# EAGLE design Data-logger_v01-03 (EAGLE 9.6.2)
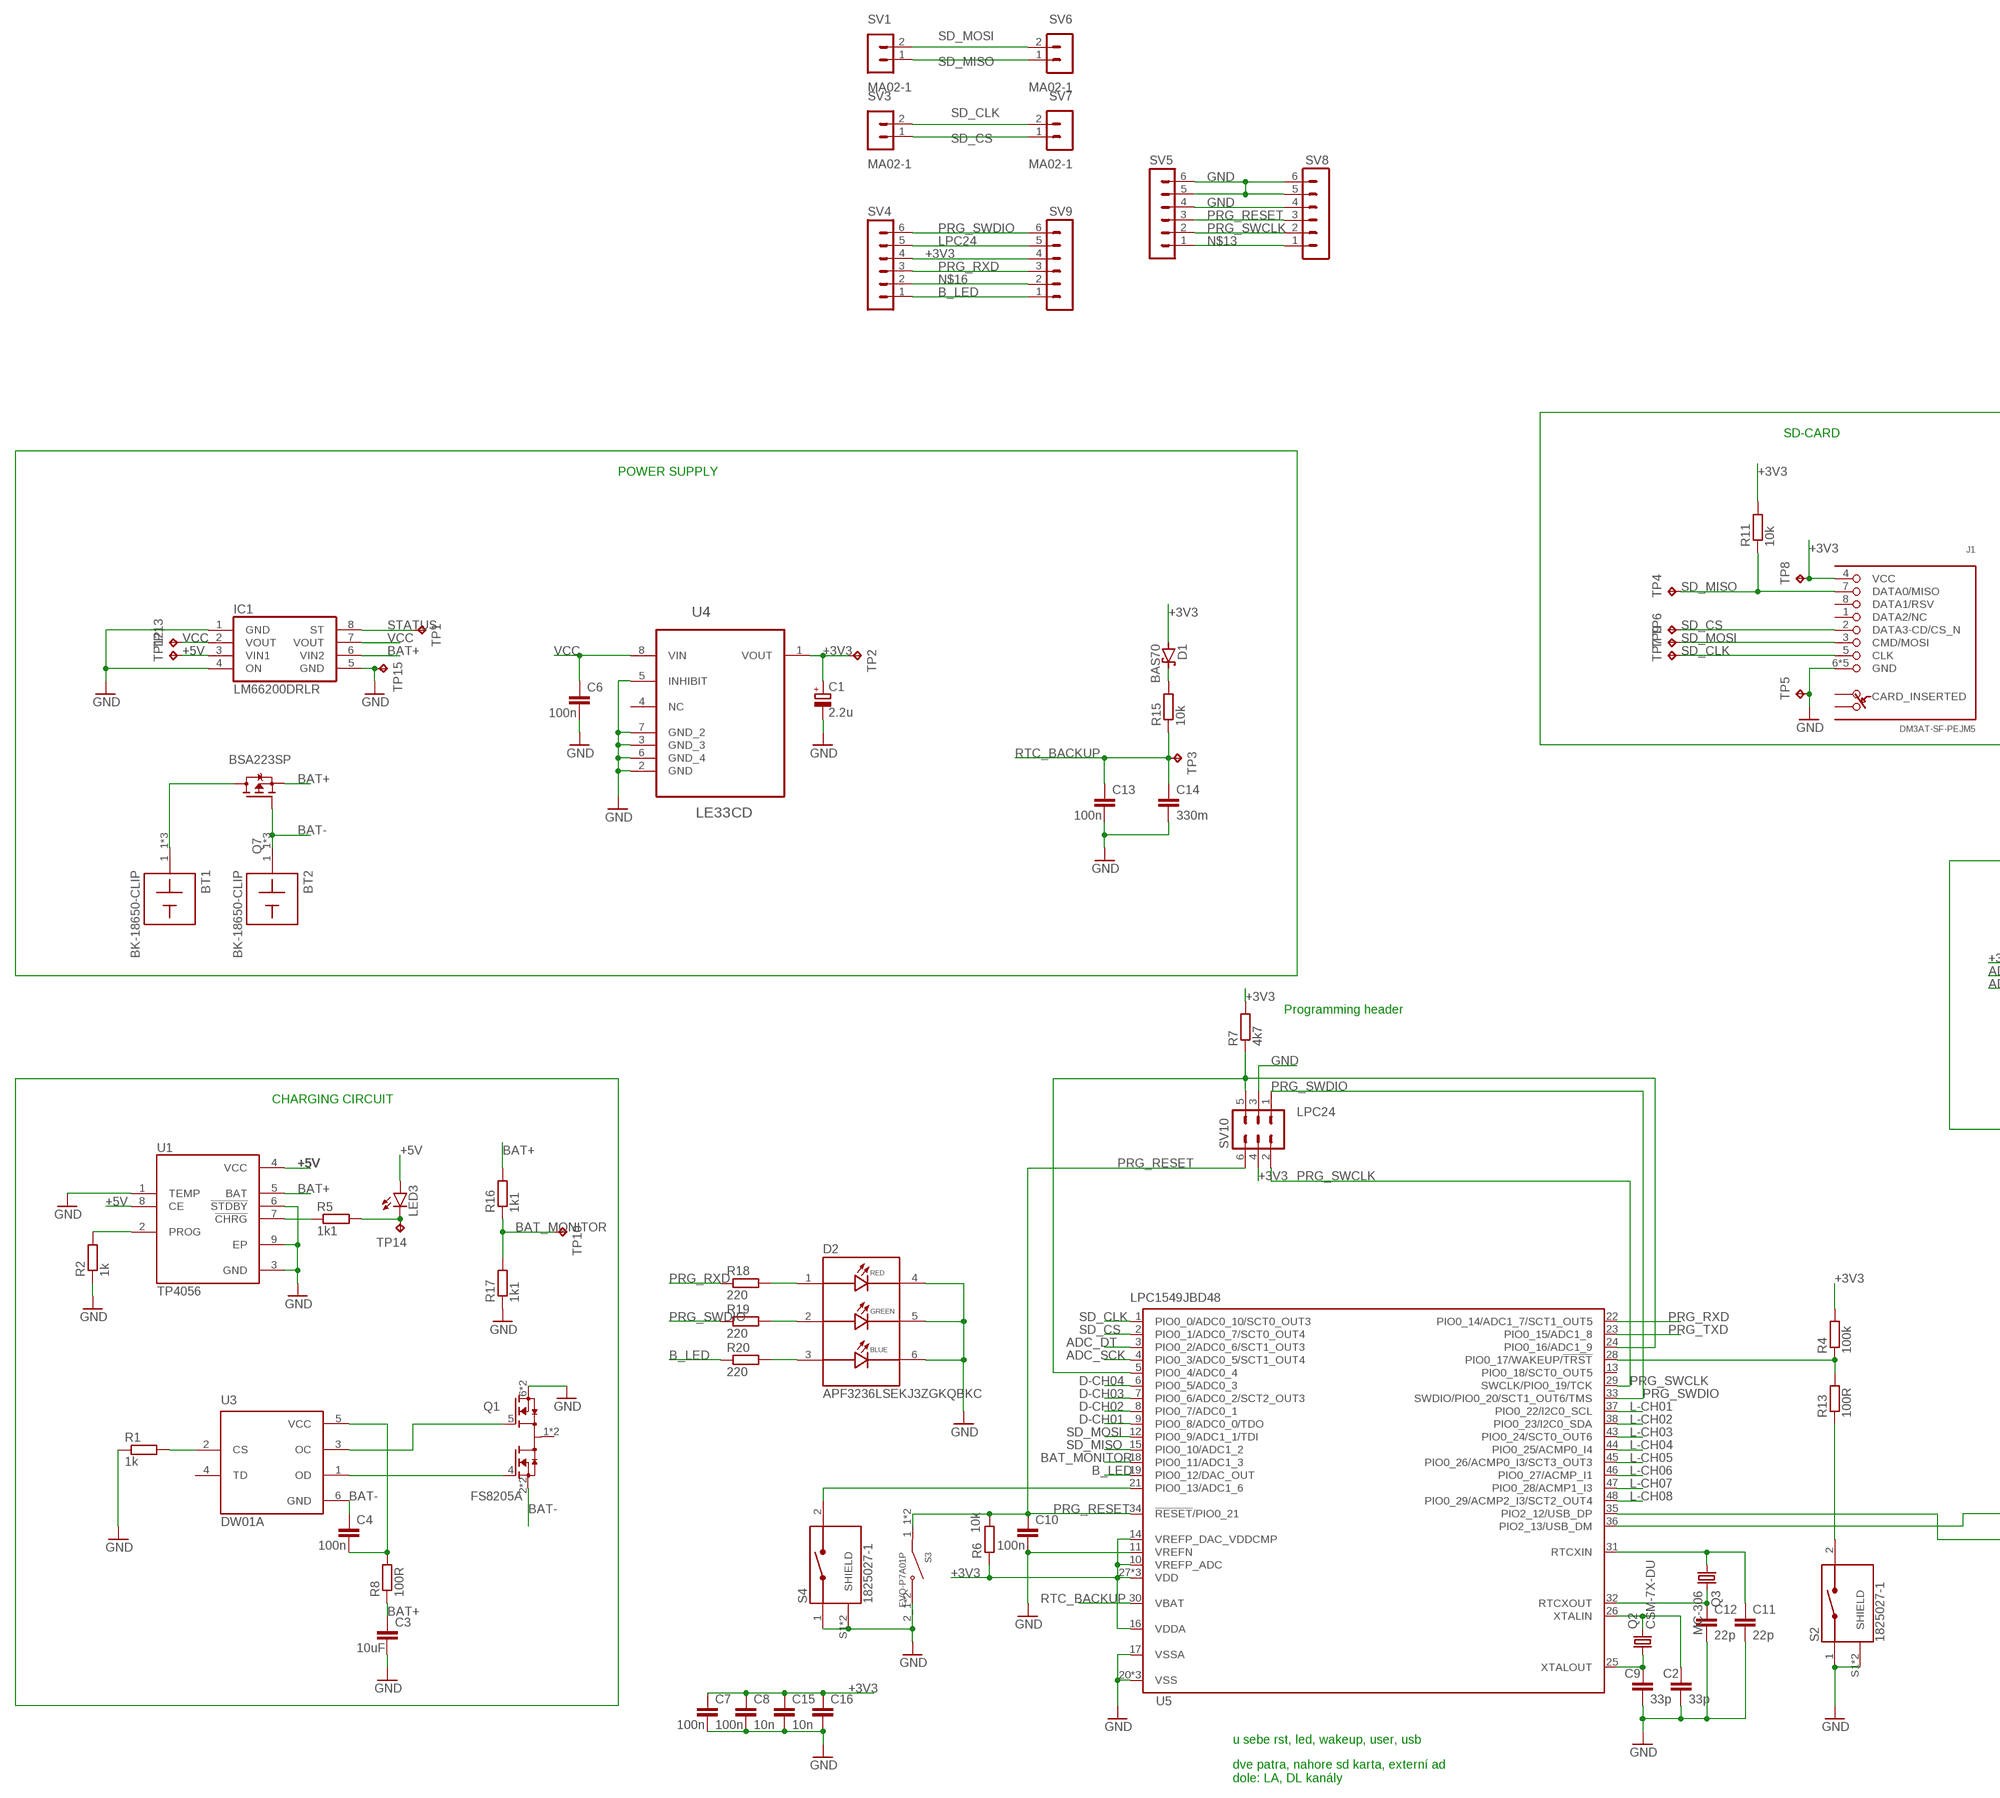
[diagram p0: schematic, sheet 1, part 1 of 2]
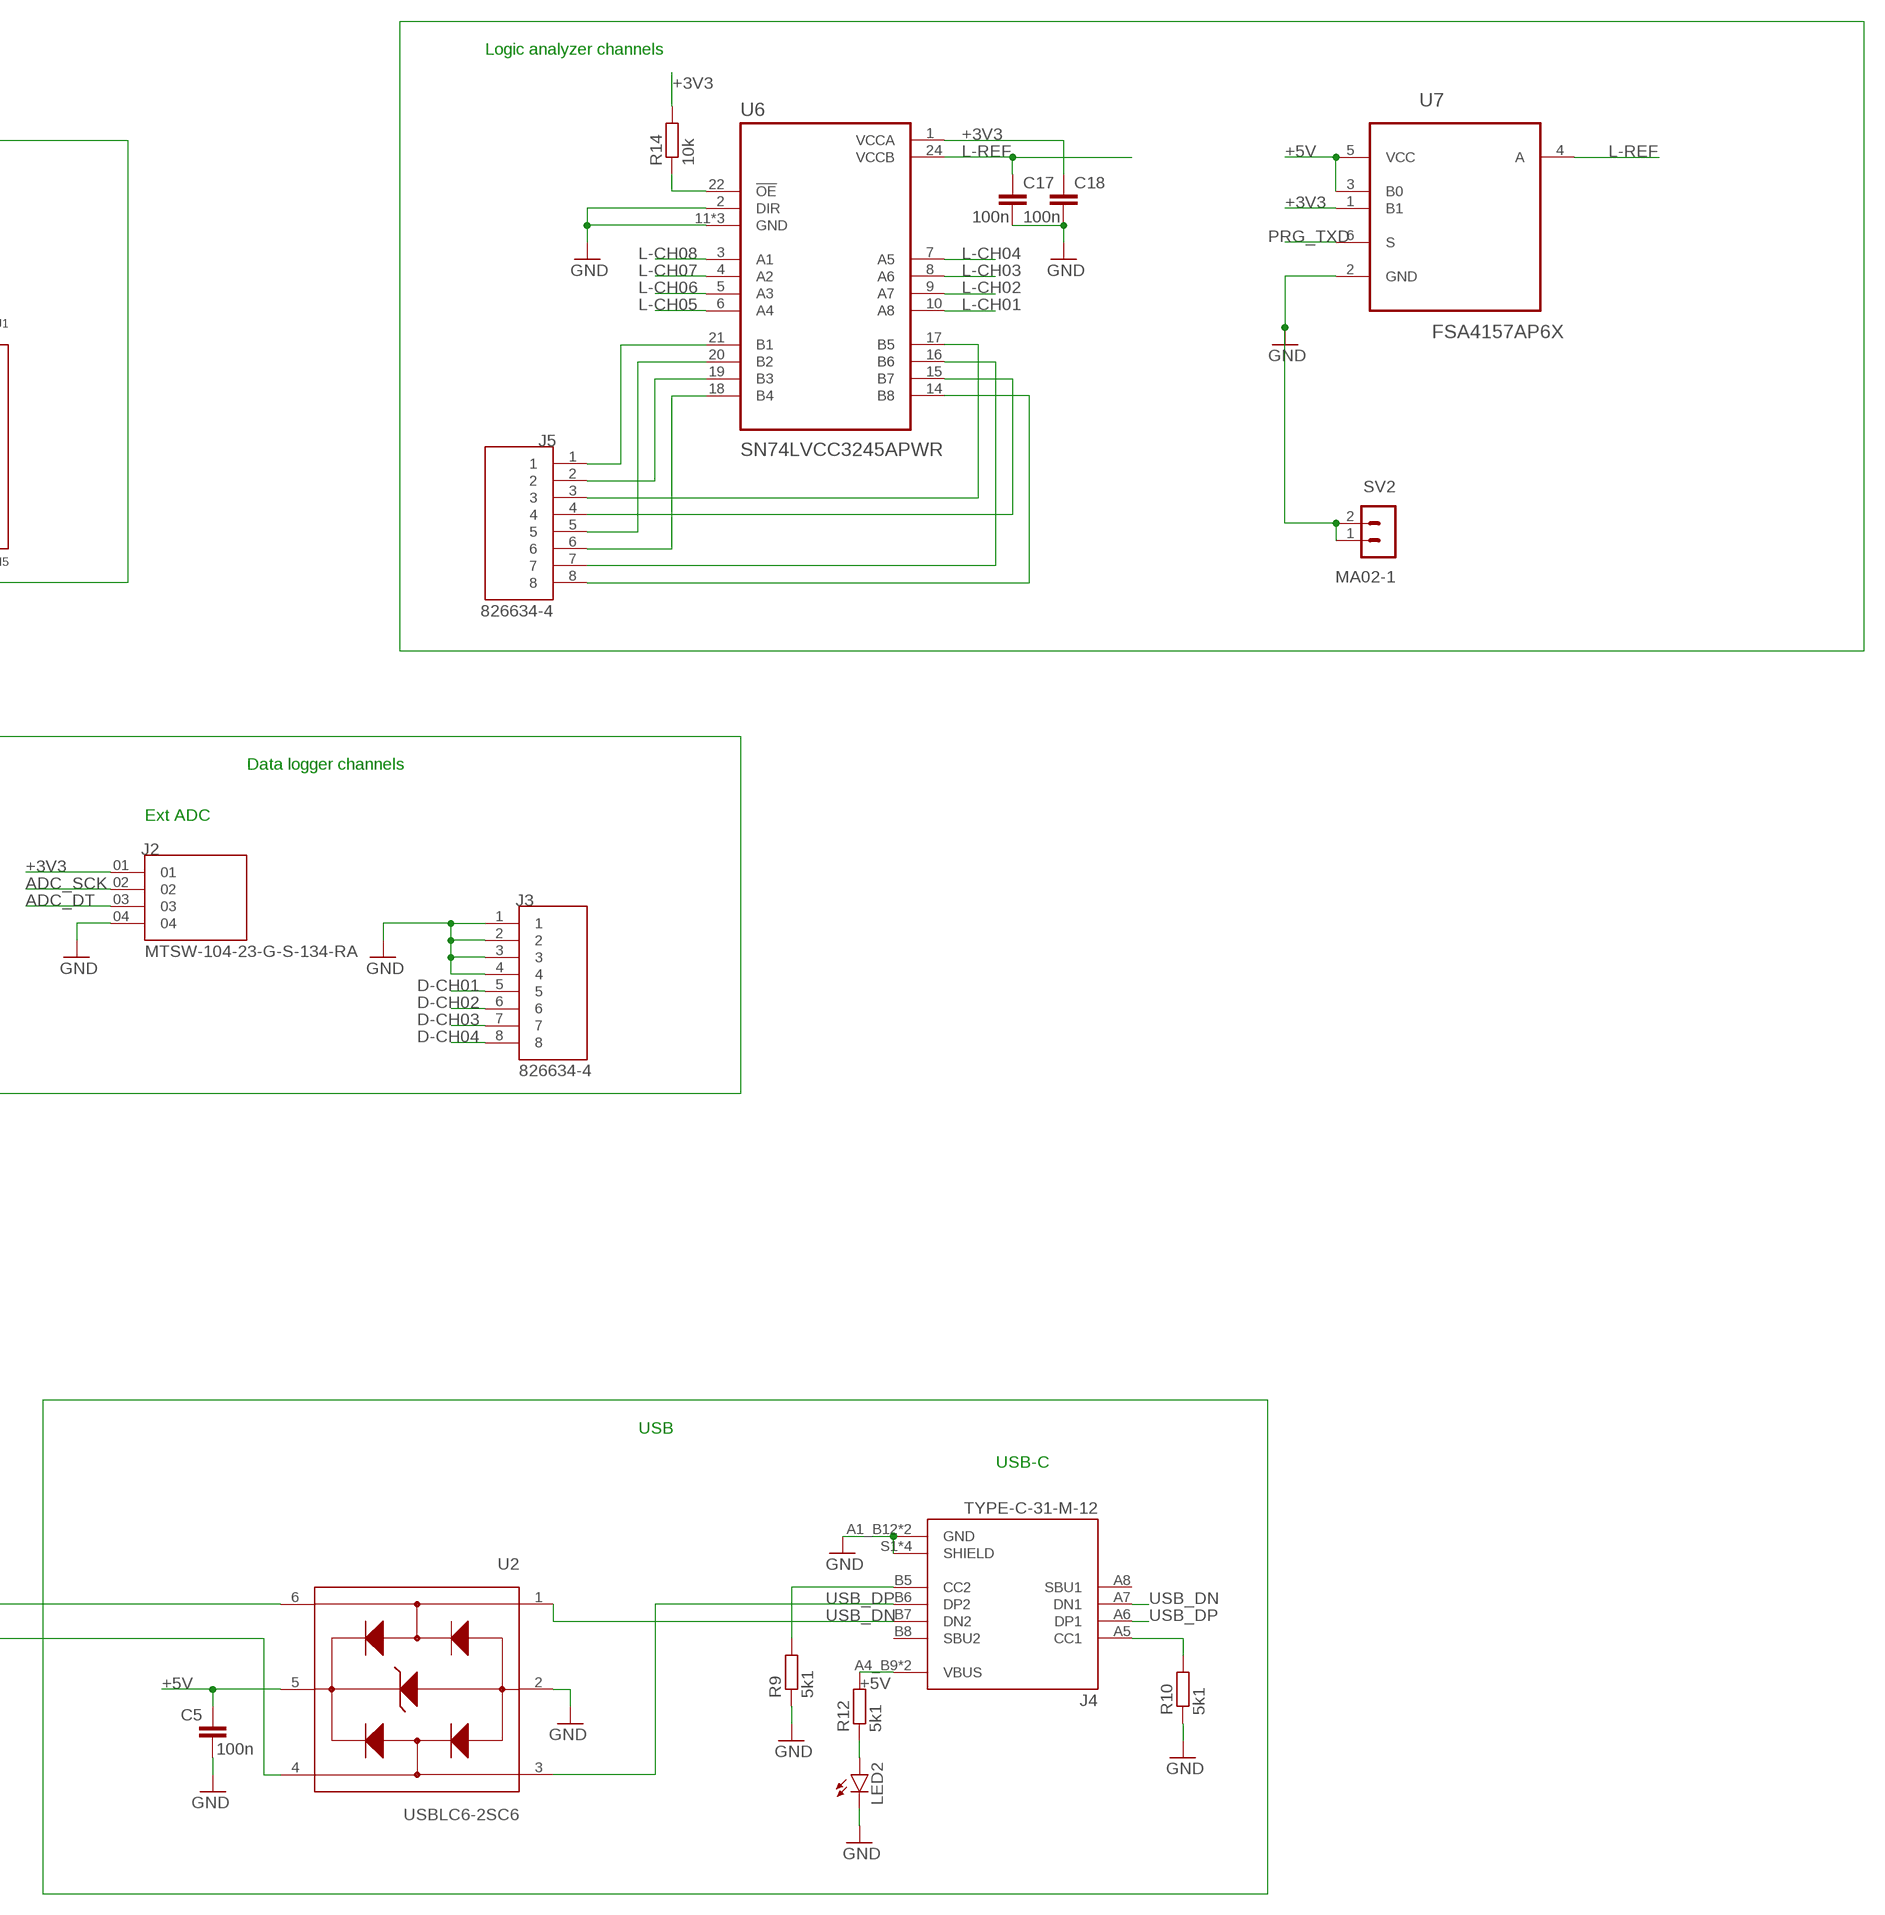
[diagram p1: schematic, sheet 1, part 2 of 2]

## Parts
BT1  BK-18650-CLIP  [BAT_BK-18650-CLIP]
BT2  BK-18650-CLIP  [BAT_BK-18650-CLIP]
C1  2.2u  CPOL-EU140CLH-0810  [140CLH-0810]
C2  33p  C-EUC0805  [C0805]
C3  10uF  C-EUC0805  [C0805]
C4  100n  C-EUC0805  [C0805]
C5  100n  C-EUC0805  [C0805]
C6  100n  C-EUC0805  [C0805]
C7  100n  C-EUC0805  [C0805]
C8  100n  C-EUC0805  [C0805]
C9  33p  C-EUC0805  [C0805]
C10  100n  C-EUC0805  [C0805]
C11  22p  C-EUC0805  [C0805]
C12  22p  C-EUC0805  [C0805]
C13  100n  C-EUC0805  [C0805]
C14  330m  C-EU050-050X075  [C050-050X075]
C15  10n  C-EUC0805  [C0805]
C16  10n  C-EUC0805  [C0805]
C17  100n  C-EUC0805  [C0805]
C18  100n  C-EUC0805  [C0805]
D1  BAS70  [SOT23]
D2  APF3236LSEKJ3ZGKQBKC  [LED_APF3236LSEKJ3ZGKQBKC]
IC1  LM66200DRLR  [SOT8]
J1  DM3AT-SF-PEJM5  [DM3AT-SF-PEJM5]
J2  MTSW-104-23-G-S-134-RA  [SAMTEC_MTSW-104-23-G-S-134-RA]
J3  826634-4  [TE_826634-4]
J4  TYPE-C-31-M-12  [HRO_TYPE-C-31-M-12]
J5  826634-4  [TE_826634-4]
LED2  LEDCHIPLED_1206  [CHIPLED_1206]
LED3  LEDCHIPLED_1206  [CHIPLED_1206]
Q1  FS8205A  [SOP65P640X120-8N]
Q2  CSM-7X-DU  [CSM-7X-DU]
Q3  MC-306  [MC-306]
Q7  BSA223SP  [SC75_INFINEON]
R1  1k  R-EU_R0805  [R0805]
R2  1k  R-EU_R0805  [R0805]
R4  100k  R-EU_R0805  [R0805]
R5  1k1  R-EU_R0805  [R0805]
R6  10k  R-EU_R0805  [R0805]
R7  4k7  R-EU_R0805  [R0805]
R8  100R  R-EU_R0805  [R0805]
R9  5k1  R-EU_R0805  [R0805]
R10  5k1  R-EU_R0805  [R0805]
R11  10k  R-EU_R0805  [R0805]
R12  5k1  R-EU_R0805  [R0805]
R13  100R  R-EU_R0805  [R0805]
R14  10k  R-EU_R0805  [R0805]
R15  10k  R-EU_R0805  [R0805]
R16  1k1  R-EU_R0805  [R0805]
R17  1k1  R-EU_R0805  [R0805]
R18  220  R-EU_R0805  [R0805]
R19  220  R-EU_R0805  [R0805]
R20  220  R-EU_R0805  [R0805]
S2  1825027-1  [SW_1825027-1]
S3  EVQ-P7A01P  [SW_EVQ-P7A01P]
S4  1825027-1  [SW_1825027-1]
SV1  MA02-1  [MA02-1]
SV2  MA02-1  [MA02-1]
SV3  MA02-1  [MA02-1]
SV4  MA06-1  [MA06-1]
SV5  MA06-1  [MA06-1]
SV6  MA02-1  [MA02-1]
SV7  MA02-1  [MA02-1]
SV8  MA06-1  [MA06-1]
SV9  MA06-1  [MA06-1]
SV10  MA03-2  [MA03-2]
TP1  TPB1,27  [B1,27]
TP2  TPB1,27  [B1,27]
TP3  TPB1,27  [B1,27]
TP4  TPB1,27  [B1,27]
TP5  TPB1,27  [B1,27]
TP6  TPB1,27  [B1,27]
TP7  TPB1,27  [B1,27]
TP8  TPB1,27  [B1,27]
TP9  TPB1,27  [B1,27]
TP10  TPB1,27  [B1,27]
TP12  TPB1,27  [B1,27]
TP13  TPB1,27  [B1,27]
TP14  TPB1,27  [B1,27]
TP15  TPB1,27  [B1,27]
U1  TP4056  [SOP127P600X175-9N]
U2  USBLC6-2SC6  [SOT95P280X145-6N]
U3  DW01A  [SOT95P280X145-6N]
U4  LE33CD  [SOIC127P600X175-8N]
U5  LPC1549JBD48  [SOT313-2]
U6  SN74LVCC3245APWR  [SOP65P640X120-24N]
U7  FSA4157AP6X  [SOT65P210X110-6N]

## Nets
+3V3: C1.+ C7.1 C8.1 C15.1 C16.1 C18.1 D1.1(A) J1.4(VCC) J2.01 R4.2 R6.1 R7.2 R11.2 R14.2 SV4.4 SV9.4 SV10.4 TP2.TP TP8.TP U4.1(VOUT) U5.10(VREFP_ADC) U5.14(VREFP_DAC_VDDCMP) U5.16(VDDA) U5.27(VDD) U5.39(VDD) U5.42(VDD) U6.1(VCCA) U7.1(B1)
+5V: C5.1 IC1.3(VIN1) J4.A4_B9(VBUS) J4.B4_A9(VBUS) LED3.A R12.2 TP12.TP U1.4(VCC) U1.8(CE) U2.5(VBUS) U7.3(B0) U7.5(VCC)
ADC_DT: J2.03 U5.3(PIO0_2/ADC0_6/SCT1_OUT3)
ADC_SCK: J2.02 U5.4(PIO0_3/ADC0_5/SCT1_OUT4)
B_LED: R20.1 SV4.1 SV9.1 U5.19(PIO0_12/DAC_OUT)
BAT+: C3.1 IC1.6(VIN2) Q7.3(S) R8.1 R16.2 U1.5(BAT)
BAT-: BT2.1_1 BT2.1_2 BT2.1_3 C4.1 Q1.2(S1) Q1.3(S1) Q7.1(G) U3.6(GND)
BAT_MONITOR: R16.1 R17.2 TP10.TP U5.18(PIO0_11/ADC1_3)
D-CH01: J3.5 U5.9(PIO0_8/ADC0_0/TDO)
D-CH02: J3.6 U5.8(PIO0_7/ADC0_1)
D-CH03: J3.7 U5.7(PIO0_6/ADC0_2/SCT2_OUT3)
D-CH04: J3.8 U5.6(PIO0_5/ADC0_3)
GND: C1.- C2.2 C3.2 C5.2 C6.2 C7.2 C8.2 C9.2 C10.2 C11.2 C12.2 C13.2 C14.2 C15.2 C16.2 C17.2 C18.2 D2.4(R_C) D2.5(G_C) D2.6(B_C) IC1.1(GND) IC1.4(ON) IC1.5(GND) J1.6(GND) J1.MOUNT0(GND) J1.MOUNT1(GND) J1.MOUNT2(GND) J1.MOUNT3(GND) J2.04 J3.1 J3.2 J3.3 J3.4 J4.A1_B12(GND) J4.B1_A12(GND) J4.S1(SHIELD) J4.S2(SHIELD) J4.S3(SHIELD) J4.S4(SHIELD) LED2.C Q1.6(S2) Q1.7(S2) R1.1 R2.1 R9.1 R10.1 R17.1 S2.1 S2.S1(SHIELD) S2.S2(SHIELD) S3.2_1 S3.2_2 S4.1 S4.S1(SHIELD) S4.S2(SHIELD) SV2.1 SV2.2 SV5.4 SV5.5 SV5.6 SV8.4 SV8.5 SV8.6 SV10.3 TP5.TP TP15.TP U1.1(TEMP) U1.3(GND) U1.6(!STDBY) U1.9(EP) U2.2(GND) U4.2(GND) U4.3(GND_3) U4.5(INHIBIT) U4.6(GND_4) U4.7(GND_2) U5.11(VREFN) U5.17(VSSA) U5.20(VSS) U5.40(VSS) U5.41(VSS) U6.2(DIR) U6.11(GND) U6.12(GND) U6.13(GND) U7.2(GND)
L-CH01: U5.37(PIO0_22/I2C0_SCL) U6.10(A8)
L-CH02: U5.38(PIO0_23/I2C0_SDA) U6.9(A7)
L-CH03: U5.43(PIO0_24/SCT0_OUT6) U6.8(A6)
L-CH04: U5.44(PIO0_25/ACMP0_I4) U6.7(A5)
L-CH05: U5.45(PIO0_26/ACMP0_I3/SCT3_OUT3) U6.6(A4)
L-CH06: U5.46(PIO0_27/ACMP_I1) U6.5(A3)
L-CH07: U5.47(PIO0_28/ACMP1_I3) U6.4(A2)
L-CH08: U5.48(PIO0_29/ACMP2_I3/SCT2_OUT4) U6.3(A1)
L-REF: C17.1 U6.24(VCCB) U7.4(A)
LPC24: R7.1 SV4.5 SV9.5 SV10.5 U5.5(PIO0_4/ADC0_4) U5.24(PIO0_16/ADC1_9)
LPC25: C9.1 Q2.1 U5.25(XTALOUT)
LPC26: C2.1 Q2.2 U5.26(XTALIN)
LPC31: C11.1 Q3.1 U5.31(RTCXIN)
LPC32: C12.1 Q3.4 U5.32(RTCXOUT)
LPC_DM: U2.4(I/O2_OUT) U5.35(PIO2_12/USB_DP)
N$1: R2.2 U1.2(PROG)
N$2: C4.2 R8.2 U3.5(VCC)
N$3: R1.2 U3.2(CS)
N$4: Q1.4(G1) U3.1(OD)
N$5: Q1.5(G2) U3.3(OC)
N$6: R5.1 U1.7(!CHRG)
N$7: J4.A5(CC1) R10.2
N$8: LED3.C R5.2 TP14.TP
N$13: R4.1 R13.2 SV5.1 SV8.1 U5.28(PIO0_17/WAKEUP/!TRST)
N$14: R13.1 S2.2
N$15: J4.B5(CC2) R9.2
N$16: S4.2 SV4.2 SV9.2 U5.21(PIO0_13/ADC1_6)
N$19: LED2.A R12.1
N$20: J5.1 U6.21(B1)
N$21: J5.5 U6.20(B2)
N$22: D2.1(R_A) R18.2
N$23: D1.3(C) R15.2
N$24: D2.2(G_A) R19.2
N$25: D2.3(B_A) R20.2
N$26: J5.2 U6.19(B3)
N$27: BT1.1_1 BT1.1_2 BT1.1_3 Q7.2(D)
N$28: J5.6 U6.18(B4)
N$29: J5.3 U6.17(B5)
N$30: J5.7 U6.16(B6)
N$31: J5.8 U6.14(B8)
N$32: J5.4 U6.15(B7)
N$33: U2.6(I/O1_OUT) U5.36(PIO2_13/USB_DM)
N$34: R14.1 U6.22(!OE)
PRG_RESET: C10.1 R6.2 S3.1_1 S3.1_2 SV5.3 SV8.3 SV10.6 U5.34(!RESET!/PIO0_21)
PRG_RXD: R18.1 SV4.3 SV9.3 U5.22(PIO0_14/ADC1_7/SCT1_OUT5)
PRG_SWCLK: SV5.2 SV8.2 SV10.2 U5.29(SWCLK/PIO0_19/TCK)
PRG_SWDIO: R19.1 SV4.6 SV9.6 SV10.1 U5.33(SWDIO/PIO0_20/SCT1_OUT6/TMS)
PRG_TXD: U5.23(PIO0_15/ADC1_8) U7.6(S)
RTC_BACKUP: C13.1 C14.1 R15.1 TP3.TP U5.30(VBAT)
SD_CLK: J1.5(CLK) SV3.2 SV7.2 TP7.TP U5.1(PIO0_0/ADC0_10/SCT0_OUT3)
SD_CS: J1.2(DATA3-CD/CS_N) SV3.1 SV7.1 TP6.TP U5.2(PIO0_1/ADC0_7/SCT0_OUT4)
SD_MISO: J1.7(DATA0/MISO) R11.1 SV1.1 SV6.1 TP4.TP U5.15(PIO0_10/ADC1_2)
SD_MOSI: J1.3(CMD/MOSI) SV1.2 SV6.2 TP9.TP U5.12(PIO0_9/ADC1_1/TDI)
STATUS: IC1.8(ST) TP1.TP
USB_DN: J4.A7(DN1) J4.B7(DN2) U2.1(I/O1_IN)
USB_DP: J4.A6(DP1) J4.B6(DP2) U2.3(I/O2_IN)
VCC: C6.1 IC1.2(VOUT) IC1.7(VOUT) TP13.TP U4.8(VIN)
Unconnected: J1.1(DATA2/NC) J1.8(DATA1/RSV) J1.A J1.B J4.A8(SBU1) J4.B8(SBU2) Q1.1(D12) Q1.8(D12) U3.4(TD) U4.4(NC) U5.13(PIO0_18/SCT0_OUT5)

## Notes on the sheet
- Logic analyzer channels
- SD-CARD
- POWER SUPPLY
- Data logger channels
- Ext ADC
- Programming header
- CHARGING CIRCUIT
- USB
- USB-C
- u sebe rst, led, wakeup, user, usb
- dve patra, nahore sd karta, externí ad
  dole: LA, DL kanály

## Library data of the parts
BT1 BT2 = BK-18650-CLIP:BK-18650-CLIP: Check availability <https://pricing.snapeda.com/parts/BK-18650-CLIP/MPD%20%28Memory%20Protection%20Devices%29/view-part?ref=eda>; AVAILABILITY: In Stock; CHECK_PRICES: https://www.snapeda.com/parts/BK-18650-CLIP/MPD/view-part/?ref=eda; DESCRIPTION: Battery Contact Clip 18650 1 Cell PC Pin; MF: MPD (Memory Protection Devices); MP: BK-18650-CLIP; PACKAGE: None; PRICE: None; SNAPEDA_LINK: https://www.snapeda.com/parts/BK-18650-CLIP/MPD/view-part/?ref=snap
C1 = rcl:CPOL-EU: POLARIZED CAPACITOR, European symbol; SPICEPREFIX: C
C2-C18 = rcl:C-EU: CAPACITOR, European symbol; SPICEPREFIX: C
D1 = diode:BAS70: Silicon Schottky Diodes General-purpose diode for high-speed switching
D2 = rgb_led:APF3236LSEKJ3ZGKQBKC: Check availability <https://pricing.snapeda.com/parts/APF3236LSEKJ3ZGKQBKC/Kingbright/view-part?ref=eda>; AVAILABILITY: In Stock; CHECK_PRICES: https://www.snapeda.com/parts/APF3236LSEKJ3ZGKQBKC/Kingbright/view-part/?ref=eda; DESCRIPTION: Red, Green, Blue (RGB) 625nm Red, 525nm Green, 465nm Blue LED Indication - Discrete 1.8V Red, 2.7V Green, 2.7V Blue 6-SMD, No Lead; MF: Kingbright; MP: APF3236LSEKJ3ZGKQBKC; PACKAGE: SMD-6 Kingbright; PRICE: None; SNAPEDA_LINK: https://www.snapeda.com/parts/APF3236LSEKJ3ZGKQBKC/Kingbright/view-part/?ref=snap
IC1 = LM66200DRLR:LM66200DRLR: Check availability <https://pricing.snapeda.com/parts/LM66200DRLR/Texas%20Instruments/view-part?ref=eda>; AVAILABILITY: In Stock; CHECK_PRICES: https://www.snapeda.com/parts/LM66200DRLR/Texas+Instruments/view-part/?ref=eda; DESCRIPTION: 1.6-V to 5.5-V, 40-mΩ, 2.5-A, low-IQ, dual ideal diode; MF: Texas Instruments; MP: LM66200DRLR; PACKAGE: None; PRICE: None; SNAPEDA_LINK: https://www.snapeda.com/parts/LM66200DRLR/Texas+Instruments/view-part/?ref=snap
J1 = sd_card_DM3AT-SF-PEJM5:DM3AT-SF-PEJM5: CONN MICRO SD R/A PUSH-PUSH SMD; DESCRIPTION: CONN MICRO SD CARD PUSH-PUSH R/A; DIGIKEY: HR1964CT-ND; MANUFACTURER: Hirose Electric Co Ltd; MPN: DM3AT-SF-PEJM5
J2 = MTSW-104-23-G-S-134-RA:MTSW-104-23-G-S-134-RA: Check availability <https://pricing.snapeda.com/parts/MTSW-104-23-G-S-134-RA/Samtec/view-part?ref=eda>; AVAILABILITY: In Stock; CHECK_PRICES: https://www.snapeda.com/parts/MTSW-104-23-G-S-134-RA/Samtec/view-part/?ref=eda; DESCRIPTION: Connector Header Through Hole, Right Angle 4 position 0.100 (2.54mm); MF: Samtec; MP: MTSW-104-23-G-S-134-RA; PACKAGE: None; PRICE: None; SNAPEDA_LINK: https://www.snapeda.com/parts/MTSW-104-23-G-S-134-RA/Samtec/view-part/?ref=snap
J3 J5 = 826634-4:826634-4: Check availability <https://pricing.snapeda.com/parts/826634-4/TE%20Connectivity/view-part?ref=eda>; AVAILABILITY: In Stock; CHECK_PRICES: https://www.snapeda.com/parts/826634-4/TE+Connectivity+AMP+Connectors/view-part/?ref=eda; COMMENT: 826634-4; DESCRIPTION: PCB Header, 2x4, Right Angle, Gold, AMPMODU Mod II Series | TE Connectivity 826634-4; EU_ROHS_COMPLIANCE: Compliant; MF: TE Connectivity; MP: 826634-4; PACKAGE: None; PRICE: None; SNAPEDA_LINK: https://www.snapeda.com/parts/826634-4/TE+Connectivity+AMP+Connectors/view-part/?ref=snap
J4 = TYPE-C-31-M-12:TYPE-C-31-M-12: Check availability <https://pricing.snapeda.com/parts/TYPE-C-31-M-12/HRO%20Electronics%20Co.%2C%20Ltd./view-part?ref=eda>; AVAILABILITY: Not in stock; CHECK_PRICES: https://www.snapeda.com/parts/TYPE-C-31-M-12/HRO+Electronics+Co.%252C+Ltd./view-part/?ref=eda; DESCRIPTION: USB Connectors 24 Receptacle 1 8.94*7.3mm RoHS; MF: HRO Electronics Co., Ltd.; MP: TYPE-C-31-M-12; PACKAGE: Package; PRICE: None; SNAPEDA_LINK: https://www.snapeda.com/parts/TYPE-C-31-M-12/HRO+Electronics+Co.%252C+Ltd./view-part/?ref=snap
LED2 LED3 = led:LED: LED OSRAM: - CHIPLED LG R971, LG N971, LY N971, LG Q971, LY Q971, LO R971, LY R971 LH N974, LH R974 LS Q976, LO Q976, LY Q976 LO Q996 - Hyper CHIPLED LW Q18S LB Q993, LB Q99A, LB R99A - SideLED LS A670, LO A670, LY A670, LG A670, LP A670 LB A673, LV A673, LT A673, LW A673 LH A674 LY A675 LS A676, LA A676, LO A676, LY A676, LW A676 LS A679, LY A679, LG A679 - Hyper Micro SIDELED® LS Y876, LA Y876, LO Y876, LY Y876 LT Y87S - SmartLED LW L88C, LW L88S LB L89C, LB L89S, LG L890 LS L89K, LO L89K, LY L89K LS L896, LA L896, LO L896, LY L896 - TOPLED LS T670, LO T670, LY T670, LG T670, LP T670 LSG T670, LSP T670, LSY T670, LOP T670, LYG T670 LG T671, LOG T671, LSG T671 LB T673, LV T673, LT T673, LW T673 LH T674 LS T676, LA T676, LO T676, LY T676, LB T676, LH T676, LSB T676, LW T676 LB T67C, LV T67C, LT T67C, LS T67K, LO T67K, LY T67K, LW E67C LS E67B, LA E67B, LO E67B, LY E67B, LB E67C, LV E67C, LT E67C LW T67C LS T679, LY T679, LG T679 LS T770, LO T770, LY T770, LG T770, LP T770 LB T773, LV T773, LT T773, LW T773 LH T774 LS E675, LA E675, LY E675, LS T675 LS T776, LA T776, LO T776, LY T776, LB T776 LHGB T686 LT T68C, LB T68C - Hyper Mini TOPLED® LB M676 - Mini TOPLED Santana® LG M470 LS M47K, LO M47K, LY M47K Source: http://www.osram.convergy.de LUXEON: - LUMILED® LXK2-PW12-R00, LXK2-PW12-S00, LXK2-PW14-U00, LXK2-PW14-V00 LXK2-PM12-R00, LXK2-PM12-S00, LXK2-PM14-U00 LXK2-PE12-Q00, LXK2-PE12-R00, LXK2-PE12-S00, LXK2-PE14-T00, LXK2-PE14-U00 LXK2-PB12-K00, LXK2-PB12-L00, LXK2-PB12-M00, LXK2-PB14-N00, LXK2-PB14-P00, LXK2-PB14-Q00 LXK2-PR12-L00, LXK2-PR12-M00, LXK2-PR14-Q00, LXK2-PR14-R00 LXK2-PD12-Q00, LXK2-PD12-R00, LXK2-PD12-S00 LXK2-PH12-R00, LXK2-PH12-S00 LXK2-PL12-P00, LXK2-PL12-Q00, LXK2-PL12-R00 Source: www.luxeon.com KINGBRIGHT: KA-3528ASYC Source: www.kingbright.com
Q1 = FS8205A_TSSOP-8:FS8205A: Check availability <https://pricing.snapeda.com/parts/FS8205A/Fortune%20Semiconductor/view-part?ref=eda>; AVAILABILITY: In Stock; CHECK_PRICES: https://www.snapeda.com/parts/FS8205A/Fortune+Semiconductor/view-part/?ref=eda; MF: Fortune Semiconductor; MP: FS8205A; PACKAGE: Package; PRICE: None; SNAPEDA_LINK: https://www.snapeda.com/parts/FS8205A/Fortune+Semiconductor/view-part/?ref=snap
Q2 = crystal:CSM-7X-DU: SMD CRYSTAL Source: www.ecsxtal.com .. Crystal 3.6864MHz CSM_7X_DU.PDF; OC_FARNELL: unknown; OC_NEWARK: unknown
Q3 = crystal:MC-306: kHz RANGE CRYSTAL UNIT SMD Source: MC-306_405_406_E07X.PDF Homepage <http://www.epsontoyocom.co.jp>; MPN: MC-306 60.0KHZ 100PPM ,12.5PF; OC_FARNELL: 1278040; OC_NEWARK: 31M5576
Q7 = transistor-fet:BSA223SP: OptiMOS(R)-P Small-Signal-Transistor P-Channel, Enhancement mode, Super Logic Level (2.5 V rated) Source: http://www.infineon.com/upload/Document/BSA223SP_Rev1.3.pdf
R1 R2 R4-R20 = rcl:R-EU_: RESISTOR, European symbol; SPICEPREFIX: R
S2 S4 = ra_button_1825027-1:1825027-1: Check availability <https://pricing.snapeda.com/parts/1825027-1/TE%20Connectivity%20/%20AMP/view-part?ref=eda>; AVAILABILITY: In Stock; CHECK_PRICES: https://www.snapeda.com/parts/1825027-1/TE+Connectivity+%252F+AMP/view-part/?ref=eda; COMMENT: 1825027-1; DESCRIPTION: Tactile Switch SPST-NO Side Actuated Through Hole, Right Angle; MF: TE Connectivity / AMP; MP: 1825027-1; PACKAGE: None; PRICE: None; SNAPEDA_LINK: https://www.snapeda.com/parts/1825027-1/TE+Connectivity+%252F+AMP/view-part/?ref=snap
S3 = panasonic_EVQ-P7A01P:EVQ-P7A01P: Check availability <https://pricing.snapeda.com/parts/EVQ-P7A01P/Panasonic%20Electronic/view-part?ref=eda>; AVAILABILITY: In Stock; CHECK_PRICES: https://www.snapeda.com/parts/EVQ-P7A01P/Panasonic/view-part/?ref=eda; DESCRIPTION: Tactile Switch SPST-NO Side Actuated Surface Mount, Right Angle; MF: Panasonic Electronic; MP: EVQ-P7A01P; PACKAGE: None; PRICE: None; SNAPEDA_LINK: https://www.snapeda.com/parts/EVQ-P7A01P/Panasonic/view-part/?ref=snap
SV1-SV3 SV6 SV7 = 6x2-pin-header-2_54:MA02-1
SV4 SV5 SV8 SV9 = 6x2-pin-header-2_54:MA06-1: PIN HEADER; OC_FARNELL: unknown; OC_NEWARK: unknown
SV10 = 6x2-pin-header-2_54:MA03-2: PIN HEADER; OC_FARNELL: unknown; OC_NEWARK: unknown
TP1-TP10 TP12-TP15 = testpad:TP: Test pad
U1 = TP4056_SOP-8:TP4056: Check availability <https://pricing.snapeda.com/parts/TP4056/NanJing%20Top%20Power%20ASIC%20Corp./view-part?ref=eda>; AVAILABILITY: Not in stock; CHECK_PRICES: https://www.snapeda.com/parts/TP4056/NanJing+Top+Power+ASIC+Corp./view-part/?ref=eda; DESCRIPTION: Complete single cell Li-Ion battery with a constant current / constant voltage linear charger; MF: NanJing Top Power ASIC Corp.; MP: TP4056; PACKAGE: Package; PRICE: None; SNAPEDA_LINK: https://www.snapeda.com/parts/TP4056/NanJing+Top+Power+ASIC+Corp./view-part/?ref=snap
U2 = USBLC6-2SC6:USBLC6-2SC6: Check availability <https://pricing.snapeda.com/parts/USBLC6-2SC6/STMicroelectronics/view-part?ref=eda>; AVAILABILITY: In Stock; CHECK_PRICES: https://www.snapeda.com/parts/USBLC6-2SC6/STMicroelectronics/view-part/?ref=eda; DESCRIPTION: 17V Clamp 5A (8/20µs) Ipp Tvs Diode Surface Mount SOT-23-6; MF: STMicroelectronics; MP: USBLC6-2SC6; PACKAGE: SOT-23-6 STMicroelectronics; PRICE: None; SNAPEDA_LINK: https://www.snapeda.com/parts/USBLC6-2SC6/STMicroelectronics/view-part/?ref=snap
U3 = DW01A_SOT-23-6:DW01A: Check availability <https://pricing.snapeda.com/parts/DW01A/Fortune%20Semiconductor/view-part?ref=eda>; AVAILABILITY: Not in stock; CHECK_PRICES: https://www.snapeda.com/parts/DW01A/Fortune+Semiconductor/view-part/?ref=eda; DESCRIPTION: One Cell Lithium-ion/Polymer Battery Protection IC; MF: Fortune Semiconductor; MP: DW01A; PACKAGE: SOT-23-6 Fortune Semiconductor; PRICE: None; SNAPEDA_LINK: https://www.snapeda.com/parts/DW01A/Fortune+Semiconductor/view-part/?ref=snap
U4 = LE33CD_SOIC-8:LE33CD: Check availability <https://pricing.snapeda.com/parts/LE33CD/STMicroelectronics/view-part?ref=eda>; AVAILABILITY: In Stock; CHECK_PRICES: https://www.snapeda.com/parts/LE33CD/STMicroelectronics/view-part/?ref=eda; DESCRIPTION: Linear Voltage Regulator IC Positive Fixed 1 Output 100mA 8-SOIC; MF: STMicroelectronics; MP: LE33CD; PACKAGE: SOIC-8 STMicroelectronics; PRICE: None; SNAPEDA_LINK: https://www.snapeda.com/parts/LE33CD/STMicroelectronics/view-part/?ref=snap
U5 = LPC1549JBD48:LPC1549JBD48: Check availability <https://pricing.snapeda.com/parts/LPC1549JBD48/NXP%20Semiconductors/view-part?ref=eda>; AVAILABILITY: In Stock; CHECK_PRICES: https://www.snapeda.com/parts/LPC1549JBD48/NXP+Semiconductors/view-part/?ref=eda; DESCRIPTION: ARM® Cortex®-M3 LPC15xx Microcontroller IC 32-Bit 72MHz 256KB (256K x 8) FLASH 48-LQFP (7x7); MF: NXP Semiconductors; MP: LPC1549JBD48; PACKAGE: QFP-48 NXP; PRICE: None; SNAPEDA_LINK: https://www.snapeda.com/parts/LPC1549JBD48/NXP+Semiconductors/view-part/?ref=snap
U6 = SN74LVCC3245APWR:SN74LVCC3245APWR: Check availability <https://pricing.snapeda.com/parts/SN74LVCC3245APWR/Texas%20Instruments/view-part?ref=eda>; AVAILABILITY: In Stock; CHECK_PRICES: https://www.snapeda.com/parts/SN74LVCC3245APWR/Texas+Instruments/view-part/?ref=eda; DESCRIPTION: Octal Bus Transceiver With Adjustable Output Voltage and 3-State Outputs; MF: Texas Instruments; MP: SN74LVCC3245APWR; PACKAGE: TSSOP-24 Texas Instruments; PRICE: None; SNAPEDA_LINK: https://www.snapeda.com/parts/SN74LVCC3245APWR/Texas+Instruments/view-part/?ref=snap
U7 = FSA4157AP6X:FSA4157AP6X: Check availability <https://pricing.snapeda.com/parts/FSA4157AP6X/ON%20Semiconductor/view-part?ref=eda>; AVAILABILITY: In Stock; CHECK_PRICES: https://www.snapeda.com/parts/FSA4157AP6X/Onsemi/view-part/?ref=eda; DESCRIPTION: FSA4157A Series 1.15 Ohm SPDT SMT Low Voltage Analog Switch - SC-70-6; MF: ON Semiconductor; MP: FSA4157AP6X; PACKAGE: SC-88-6 ON Semiconductor; PRICE: None; SNAPEDA_LINK: https://www.snapeda.com/parts/FSA4157AP6X/Onsemi/view-part/?ref=snap

## Board
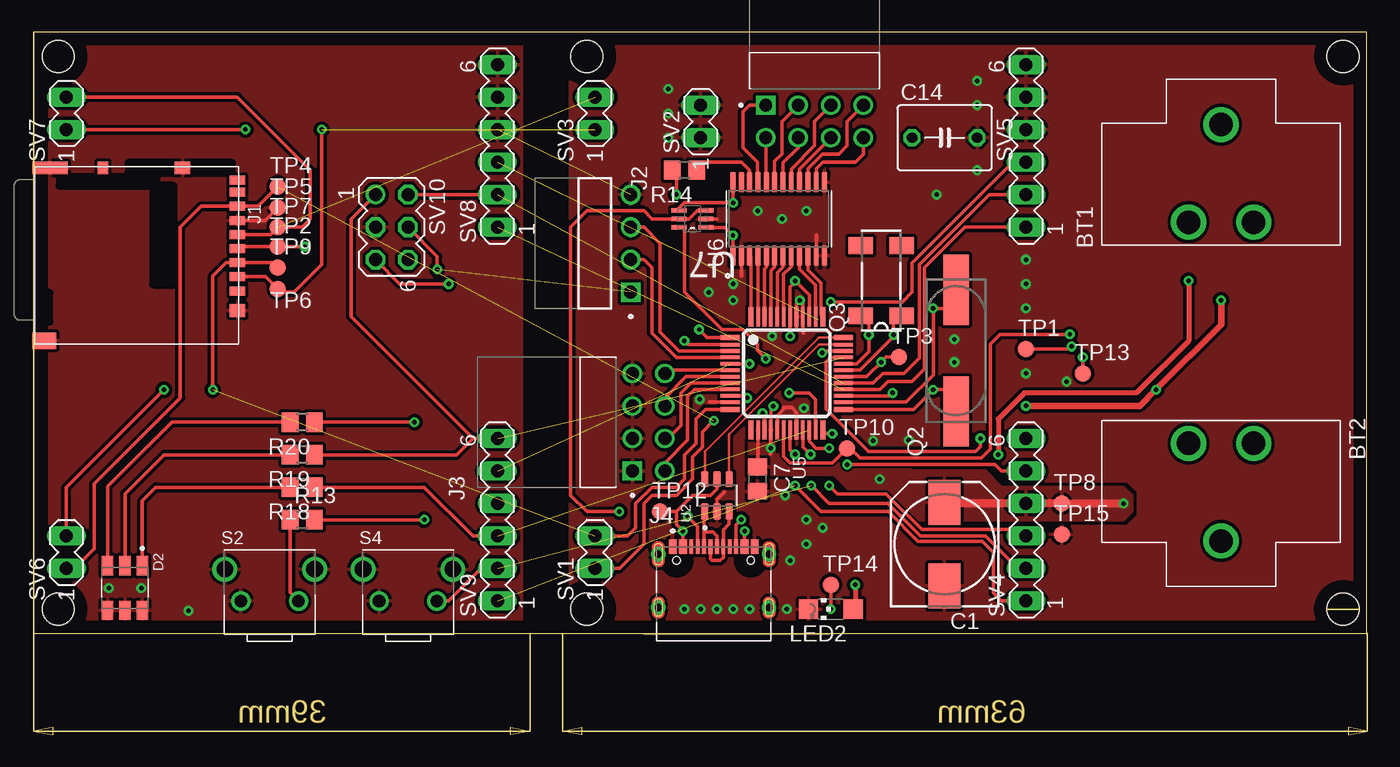
[diagram p2: board, top side]
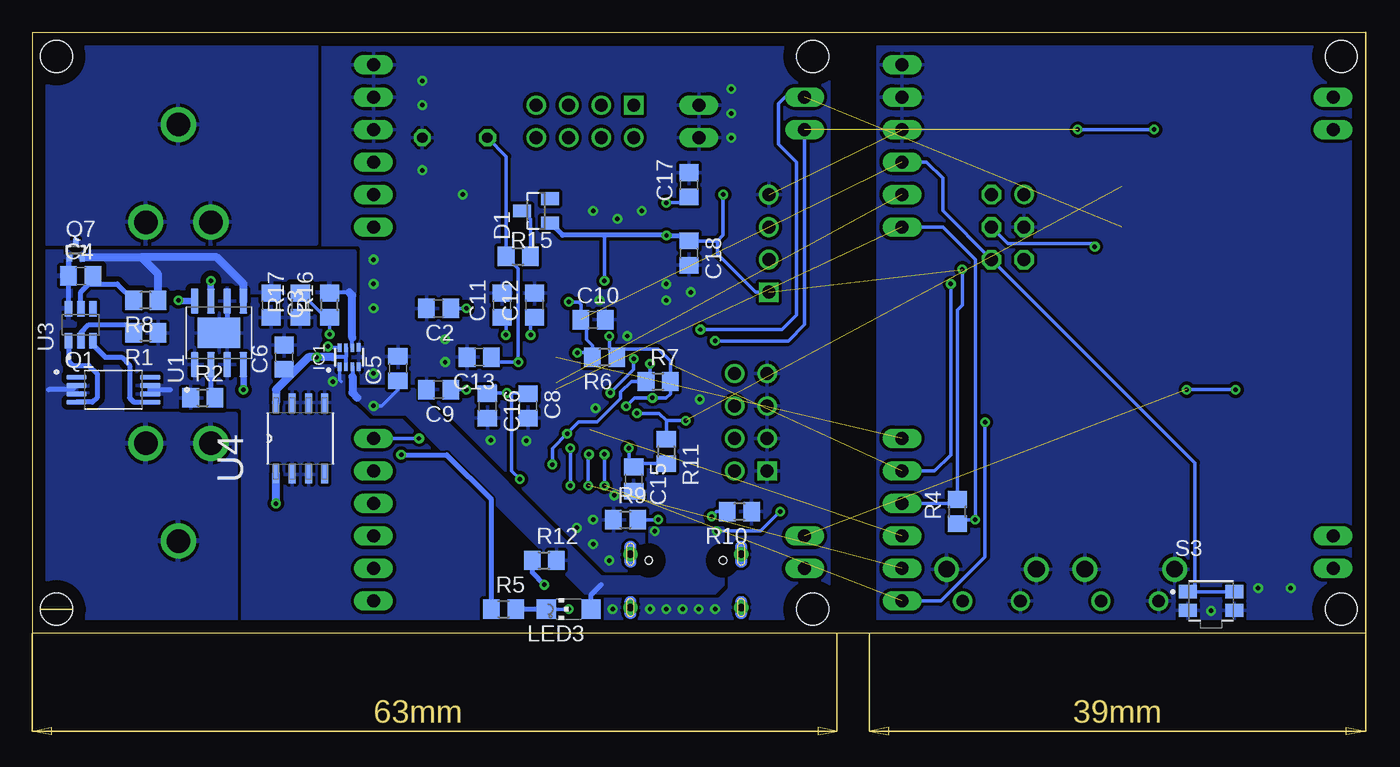
[diagram p3: board, bottom side, seen from below]

Size 104.06 x 46.98 mm. Coordinates in mm from the lower left corner, seen from the top.
Outline: 0,0 104.06,0 104.06,46.98 0,46.98 0,0
Copper layers (1*16): Top 0.035mm / dielectric 1.5mm / Bottom 0.035mm
Design rules "default": minimum track width 6mil, minimum drill 0.35mm, track to track 6mil, track to pad 6mil, pad to pad 6mil, via to via 6mil, smd to smd 6mil, copper to edge 40mil, drill to drill 6mil, minimum pad ring 10mil, minimum via ring 8mil, stop-mask expansion 4mil, vias tented up to drill 0mil, thermal gap 10mil
Holes 2.5 mm at 102.23,45.09 102.23,1.91 43.18,1.91 43.18,45.09 1.9,45.09 1.9,1.91

### Footprints (pad centres in the part's own frame; a part is rotated, then mirrored left to right if it is on the bottom)
BAT_BK-18650-CLIP = drill 1.83: 1_1 -4.695,2.54; 1_2 -4.695,-2.54; 1_3 2.925,0
140CLH-0810 = smd 3.5 x 2.5: + 3.25,0; - -3.25,0
C0805 = smd 1.3 x 1.5: 1 -0.95,0; 2 0.95,0
C050-050X075 = drill 0.813 octagon: 1 -2.54,0; 2 2.54,0
SOT23 = smd 1 x 1.4: 1 -0.95,-1.1; 2 0.95,-1.1; 3 0,1.1
LED_APF3236LSEKJ3ZGKQBKC = smd 1.5 x 0.9: 1 -1.75,1.35; 2 -1.75,0; 3 -1.75,-1.35; 4 1.75,1.35; 5 1.75,0; 6 1.75,-1.35
SOT8 = smd 0.3 x 0.67: 1 -0.75,-0.74; 2 -0.25,-0.74; 3 0.25,-0.74; 4 0.75,-0.74; 5 0.75,0.76; 6 0.25,0.74; 7 -0.25,0.74; 8 -0.75,0.74
DM3AT-SF-PEJM5 = smd 0.7 x 1.2: 1 3.2,-0.1; 2 2.1,-0.1; 3 1,-0.1; 4 -0.1,-0.1; 5 -1.2,-0.1; 6 -2.3,-0.1; 7 -3.4,-0.1; 8 -4.5,-0.1; B -5.45,-0.1 | smd 1 x 0.8: A -6.4,-10.6 | smd 1 x 1.2: MOUNT0 4.75,-0.1; MOUNT1 -6.4,-4.4 | smd 1 x 2.8: MOUNT2 -6.4,-14.75 | smd 1.3 x 1.9: MOUNT3 7.1,-15.2
SAMTEC_MTSW-104-23-G-S-134-RA = drill 1.02 pad 1.37 square: 01 3.81,2.79 | drill 1.02 pad 1.37: 02 1.27,2.79; 03 -1.27,2.79; 04 -3.81,2.79
TE_826634-4 = drill 1 square: 1 0,0 | drill 1: 2 2.54,0; 3 5.08,0; 4 7.62,0; 5 0,-2.54; 6 2.54,-2.54; 7 5.08,-2.54; 8 7.62,-2.54
HRO_TYPE-C-31-M-12 = smd 0.6 x 1.14: A1_B12 -3.2,4.75; A4_B9 -2.4,4.75; B1_A12 3.2,4.75; B4_A9 2.4,4.75 | smd 0.3 x 1.14: A5 -1.25,4.75; A6 -0.25,4.75; A7 0.25,4.75; A8 1.25,4.75; B5 1.75,4.75; B6 0.75,4.75; B7 -0.75,4.75; B8 -1.75,4.75 | drill 0.6 pad 0.9: S1 -4.325,4.17; S2 4.325,4.17; S3 -4.325,0; S4 4.325,0 | hole 0.6: -2.89,3.68; 2.89,3.68
CHIPLED_1206 = smd 1.5 x 1.5: A 0,-1.75; C 0,1.75
SOP65P640X120-8N = smd 1.56 x 0.4: 1 -2.88,0.975; 2 -2.88,0.325; 3 -2.88,-0.325; 4 -2.88,-0.975; 5 2.88,-0.975; 6 2.88,-0.325; 7 2.88,0.325; 8 2.88,0.975
CSM-7X-DU = smd 5.5 x 2: 1 -4.75,0; 2 4.75,0
MC-306 = smd 1.3 x 1.9: 1 -2.75,-1.6; 2 2.75,-1.6; 3 2.75,1.6; 4 -2.75,1.6
SC75_INFINEON = smd 0.4 x 0.65: 1 -0.5,-0.575; 2 0,0.575; 3 0.5,-0.575
R0805 = smd 1.3 x 1.5: 1 -0.95,0; 2 0.95,0
SW_1825027-1 = drill 0.99: 1 -2.25,0; 2 2.25,0 | drill 1.3: S1 -3.505,2.49; S2 3.505,2.49
SW_EVQ-P7A01P = smd 1.4 x 1.05: 1_1 -1.8,0.725; 1_2 1.8,0.725; 2_1 -1.8,-0.725; 2_2 1.8,-0.725
MA02-1 = drill 1.016 long: 1 -1.27,0; 2 1.27,0
MA06-1 = drill 1.016 long: 1 -6.35,0; 2 -3.81,0; 3 -1.27,0; 4 1.27,0; 5 3.81,0; 6 6.35,0
MA03-2 = drill 1.016: 1 -2.54,-1.27 | drill 1.016 octagon: 2 -2.54,1.27; 3 0,-1.27; 4 0,1.27; 5 2.54,-1.27; 6 2.54,1.27
B1,27 = smd 1.27 x 1.27: TP 0,0
SOP127P600X175-9N = smd 1.97 x 0.6: 1 -2.475,1.905; 2 -2.475,0.635; 3 -2.475,-0.635; 4 -2.475,-1.905; 5 2.475,-1.905; 6 2.475,-0.635; 7 2.475,0.635; 8 2.475,1.905 | smd 2.413 x 3.302: 9 0,0
SOT95P280X145-6N = smd 1.21 x 0.59: 1 -1.255,0.95; 2 -1.255,0; 3 -1.255,-0.95; 4 1.255,-0.95; 5 1.255,0; 6 1.255,0.95
SOIC127P600X175-8N = smd 1.422 x 0.533: 1 -2.794,1.905; 2 -2.794,0.635; 3 -2.794,-0.635; 4 -2.794,-1.905; 5 2.794,-1.905; 6 2.794,-0.635; 7 2.794,0.635; 8 2.794,1.905
SOT313-2 = smd 0.4 x 1.5: 1 -2.81,-4.425; 12 2.81,-4.425; 25 2.81,4.425; 36 -2.81,4.425 | smd 0.28 x 1.5: 2 -2.25,-4.425; 3 -1.75,-4.425; 4 -1.25,-4.425; 5 -0.75,-4.425; 6 -0.25,-4.425; 7 0.25,-4.425; 8 0.75,-4.425; 9 1.25,-4.425; 10 1.75,-4.425; 11 2.25,-4.425; 26 2.25,4.425; 27 1.75,4.425; 28 1.25,4.425; 29 0.75,4.425; 30 0.25,4.425; 31 -0.25,4.425; 32 -0.75,4.425; 33 -1.25,4.425; 34 -1.75,4.425; 35 -2.25,4.425 | smd 1.5 x 0.4: 13 4.425,-2.81; 24 4.425,2.81; 37 -4.425,2.81; 48 -4.425,-2.81 | smd 1.5 x 0.28: 14 4.425,-2.25; 15 4.425,-1.75; 16 4.425,-1.25; 17 4.425,-0.75; 18 4.425,-0.25; 19 4.425,0.25; 20 4.425,0.75; 21 4.425,1.25; 22 4.425,1.75; 23 4.425,2.25; 38 -4.425,2.25; 39 -4.425,1.75; 40 -4.425,1.25; 41 -4.425,0.75; 42 -4.425,0.25; 43 -4.425,-0.25; 44 -4.425,-0.75; 45 -4.425,-1.25; 46 -4.425,-1.75; 47 -4.425,-2.25
SOP65P640X120-24N = smd 1.57 x 0.41: 1 -2.87,3.575; 2 -2.87,2.925; 3 -2.87,2.275; 4 -2.87,1.625; 5 -2.87,0.975; 6 -2.87,0.325; 7 -2.87,-0.325; 8 -2.87,-0.975; 9 -2.87,-1.625; 10 -2.87,-2.275; 11 -2.87,-2.925; 12 -2.87,-3.575; 13 2.87,-3.575; 14 2.87,-2.925; 15 2.87,-2.275; 16 2.87,-1.625; 17 2.87,-0.975; 18 2.87,-0.325; 19 2.87,0.325; 20 2.87,0.975; 21 2.87,1.625; 22 2.87,2.275; 23 2.87,2.925; 24 2.87,3.575
SOT65P210X110-6N = smd 1.168 x 0.356: 1 -1.041,0.66; 2 -1.041,0; 3 -1.041,-0.66; 4 1.041,-0.66; 5 1.041,0; 6 1.041,0.66

### Placement (x,y rotation side)
BT1  92.71,36.83 90 top
BT2  92.71,10.16 270 top
C1  71.12,6.99 90 top
C2  72.39,25.4 180 bottom
C3  85.47,25.65 270 bottom
C4  100.33,27.94 0 bottom
C5  75.56,20.7 90 bottom
C6  84.45,21.59 90 bottom
C7  56.51,12.06 270 top
C8  65.41,17.78 270 bottom
C9  72.39,19.05 180 bottom
C10  60.32,24.51 0 bottom
C11  67.44,25.65 90 bottom
C12  64.9,25.65 90 bottom
C13  69.22,21.59 180 bottom
C14  71.12,38.73 0 top
C15  57.15,12.06 270 bottom
C16  68.58,17.78 270 bottom
C17  52.83,35.05 90 bottom
C18  52.83,29.72 270 bottom
D1  64.77,33.02 90 bottom
D2  7.11,3.56 270 top
IC1  79.38,21.59 0 bottom
J1  16,29.97 270 top
J2  43.81,30.48 270 top
J3  46.74,12.7 90 top
J4  53.09,2.03 0 top
J5  57.15,41.27 0 top
LED2  62.23,1.91 90 top
LED3  62.23,1.91 90 bottom
Q1  97.79,19.05 0 bottom
Q2  72.01,22.1 90 top
Q3  66.17,27.56 90 top
Q7  100.71,29.97 0 bottom
R1  95.25,23.5 180 bottom
R2  90.81,18.41 0 bottom
R4  31.88,9.53 90 bottom
R5  67.31,1.91 0 bottom
R6  59.44,21.59 180 bottom
R7  55.24,19.68 0 bottom
R8  95.25,26.04 180 bottom
R9  57.78,8.89 0 bottom
R10  48.89,9.53 180 bottom
R11  54.61,14.22 270 bottom
R12  64.14,5.71 0 bottom
R13  20.96,8.89 0 top
R14  50.8,36.2 180 top
R15  66.17,29.46 0 bottom
R16  80.9,25.65 90 bottom
R17  83.19,25.65 90 bottom
R18  20.96,11.43 180 top
R19  20.96,13.97 180 top
R20  20.96,16.51 180 top
S2  18.41,2.54 0 top
S3  12.07,2.54 0 bottom
S4  29.21,2.54 0 top
SV1  43.81,6.35 90 top
SV2  52.07,40.01 90 top
SV3  43.81,40.64 90 top
SV4  77.47,8.89 90 top
SV5  77.47,38.1 90 top
SV6  2.54,6.35 90 top
SV7  2.54,40.64 90 top
SV8  36.2,38.1 90 top
SV9  36.2,8.89 90 top
SV10  27.94,31.75 270 top
TP1  77.47,22.23 0 top
TP2  19.05,30.23 0 top
TP3  67.56,21.59 0 top
TP4  19.05,34.92 0 top
TP5  19.05,33.27 0 top
TP6  19.05,26.92 0 top
TP7  19.05,31.75 0 top
TP8  80.26,10.16 0 top
TP9  19.05,28.57 0 top
TP10  63.5,14.48 0 top
TP12  48.89,9.53 0 top
TP13  81.92,20.32 0 top
TP14  62.23,3.81 0 top
TP15  80.26,7.75 0 top
U1  89.54,23.5 90 bottom
U2  53.34,10.79 90 top
U3  100.33,24.13 90 bottom
U4  83.19,15.24 90 bottom
U5  58.8,20.32 270 top
U6  58.17,32.38 90 top
U7  51.43,32.38 180 top

### Tracks (layer width: path | path; a pad name or v marks a point on that pad's centre or on a via)
+3V3  (via drill 0.35 pad 0.08)  (1 unrouted)
  Top 0.254: U6.1 v54.59,31.1 53.96,31.73 U7.1 | U5.14 56.55,13.05 C7.1 | v67.06,18.8 66.83,18.57 U5.27 | 57.53,14.03 v57.53,14.48 57.53,15.88 U5.16 57.55,16.93 57.55,16.94 57.55,17.55 v57.75,17.75 57.78,17.78 | J1.4 16.06,30.23 TP2.TP v21.15,30.23 | U5.39 60.55,26.44 v59.44,27.56 59.5,27.5 59.05,27.05 U5.42 v59.05,23.23 | R14.2 50.16,35.88 v50.16,34.29 | v55.69,18.4 55.52,18.57 U5.10 | SV10.4 31.5,29.46 v31.5,28.45
  Top 0.61: C1.+ 71.2,10.16 TP8.TP v85.09,10.16
  Bottom 0.254: 53.26,31.1 C18.1 50.61,30.67 | v54.59,31.1 54.61,31.11 | 54.04,19.43 R7.2 | v57.53,14.48 57.53,13.4 57.31,13.18 | 57.31,13.18 C15.1 | 66.67,18.8 v67.06,18.8 68.51,18.8 C16.1 67.95,19.36 | 66.67,18.8 65.47,18.8 C8.1 65.09,18.73 64.77,19.05 | v59.44,27.56 59.44,31.11 | v50.16,34.29 50.16,31.11 50.61,30.67 | 59.05,22.23 59.05,22.16 R6.1 | 59.05,22.23 v59.05,23.23 | 59.05,22.23 55.24,22.23 54.29,21.27 R7.2 | R11.2 57.21,13.27 57.31,13.18 | SV9.4 32.19,10.16 R4.2 31.88,25.27 31.5,25.65 v31.5,28.45 | R7.2 54.29,18.73 54.62,18.4 v55.69,18.4 57.09,18.4 v57.75,17.75 | 66.67,18.8 66.67,12.7 v66.04,12.06 | J2.01 47.62,26.67 50.61,29.66 50.61,30.67 | v21.15,30.23 21.4,30.48 27.94,30.48 SV10.4
  Bottom 0.406: v54.59,31.1 53.26,31.1 | D1.1 62.71,31.11 59.44,31.11 54.61,31.11
  Bottom 0.61: v85.09,10.16 U4.1
  pour Top: 57.78,15.88 55.88,15.88 55.88,12.45 62.48,12.45 66.04,8.89 85.09,8.89 85.73,9.53 85.73,10.79 85.09,11.43 75.56,11.43 74.3,12.7 68.58,12.7 67.31,13.97 57.78,13.97
+5V  (via drill 0.35 pad 0.08)
  Top 0.254: J4.B4_A9 55.49,7.99 v55.5,8 | J4.A4_B9 50.67,6.79 v50.67,8 50.16,8.51 50.16,9.53 | U2.5 53.34,11.3 52.83,10.79 51.43,10.79 50.16,9.53 | 50.16,9.53 TP12.TP | U7.3 51.82,33.05 51.16,32.38 U7.5 48.26,32.38 47.62,33.02 43.18,33.02 41.91,31.75 41.91,10.79 43.18,9.53 v45.72,9.53
  Top 0.508: v77.47,17.78 86.36,17.78 v87.63,19.05 92.71,24.13 v92.71,26.04
  Bottom 0.254: 50.8,7.62 50.8,7.87 v50.67,8 47.24,8 v45.72,9.53 | C5.1 75.56,19.05 76.84,17.78 v77.47,17.78 | v92.71,26.04 92.65,25.97
  Bottom 0.305: IC1.3 79.12,20.07 79.12,19.82
  Bottom 0.406: 60.32,2.06 LED3.A 60.48,3.02 59.69,3.81
  Bottom 0.508: v87.63,19.05 U1.4 | 92.65,25.97 U1.8
  Bottom 0.61: 79.12,20.07 79.12,18.8 78.74,18.41
  pour Bottom: 50.16,8.26 50.16,3.81 50.8,3.17 60.96,3.17 74.93,17.14 77.47,17.14 78.74,18.41 78.74,19.05 74.3,19.05 59.69,4.45 55.88,4.45 55.88,8.26
ADC_DT
  Top 0.254: U5.3 50.37,22.07 48.89,23.54 48.89,30.48 47.62,31.75 J2.03
ADC_SCK
  Top 0.254: U5.4 50.18,21.57 48.26,23.5 48.26,28.57 47.62,29.21 J2.02
B_LED  (via drill 0.35 pad 0.08)  (1 unrouted)
  Top 0.254: U5.19 59.05,14.35 59.44,13.97 v59.44,13.99 | v59.44,11.56 61.47,9.53 66.73,9.53 69.05,7.21 74.07,7.21 74.93,6.35 74.93,3.17 75.56,2.54 SV4.1 | R20.1 v29.72,16.51
  Bottom 0.254: v59.44,13.99 v59.44,11.56 | 35.56,2.54 SV9.1 33.18,2.54 29.72,6 v29.72,16.51
BAT+
  Bottom 0.305: R16.2 80.83,26.67 79.38,26.67 | IC1.6 79.12,23.11
  Bottom 0.61: U1.5 87.63,27.3 89.72,29.4 95.63,29.4 | R8.1 94.3,28.07 95.63,29.4 | Q7.3 95.63,29.4 | 79.12,23.11 79.12,26.42 79.38,26.67
  pour Bottom (isolate 0.406): 100.33,29.84 96.52,29.84 78.99,29.84 78.99,26.67 100.33,26.67
BAT-
  Bottom 0.406: Q7.1 101.28,29.33 U3.6 | Q1.2 101,19.05 102.84,19.05
  pour Bottom (isolate 0.406): 103.51,29.84 100.97,29.84 100.97,26.04 97.16,26.04 97.16,17.14 88.27,17.14 88.27,0.64 103.51,0.64
BAT_MONITOR  (via drill 0.35 pad 0.08)
  Top 0.254: v80.9,23.37 75.44,23.37 74.68,22.61 74.68,14.41 73.98,13.72 64.52,13.72 63.75,14.48 TP10.TP 62.36,13.34 59.05,13.34 58.55,13.84 U5.18
  Bottom 0.254: 82.79,27 R17.2 83.12,26.6 81.22,24.7 R16.1 v80.9,23.37
  Bottom 0.61: R16.1 80.65,24.45
D-CH01
  Top 0.254: J3.5 49.28,13.34 51.05,15.11 51.05,18.54 51.58,19.07 U5.9
D-CH02
  Top 0.254: U5.8 51.32,19.57 50.55,18.8 50.55,16.26 49.53,15.24 J3.6
D-CH03
  Top 0.254: J3.7 49.28,18.41 50.93,20.07 U5.7
D-CH04
  Top 0.254: J3.8 49.53,20.57 U5.6
GND  (via drill 0.35 pad 0.08)  (1 unrouted)
  Top 0.254: TP5.TP 18.05,32.27 J1.6 | U7.2 53.34,32.38 | U6.2 55.24,27.94 | U6.11 61.09,31.11 | U5.11 52.7,18.07 | 58.55,17.65 58.67,17.65 | U5.20 59.55,17.28 59.18,17.65 58.67,17.65 | 59.55,23.75 U5.41 59.55,25.77 v59.82,26.04 60.05,25.8 U5.40 60.05,23.52 60.08,23.48 | U2.2 53.34,10.48 53.91,11.05 | U5.17 58.05,17.03 58.67,17.65
  Bottom 0.254: IC1.1 80.12,19.8 80.01,19.68
  Bottom 0.406: Q1.6 94.91,19.05 | 94.91,19.05 Q1.7 | 94.91,19.05 93.34,19.05 | U1.6 88.9,23.5
  other vias: 50.8,1.91 52.07,1.91 53.34,1.91 54.61,1.91 55.88,1.91 58.8,1.91 59.05,5.71 60.32,6.99 61.59,8.26 60.32,8.89 58.67,10.79 56.51,33.02 58.42,32.38 60.32,33.02 49.53,38.73 73.66,41.27 73.66,43.18 73.66,36.2 70.48,34.29 77.47,25.4 77.47,27.3 77.47,29.21 71.88,21.21 71.88,22.99 54.61,27.3 54.61,26.04 52.7,26.67 60.13,17.59 5.84,3.56 8.38,3.56 12.07,1.78 57.66,23.24 52.01,18.29 68.33,15.11 65.53,15.05 77.47,20.32 80.65,19.68 49.53,40.64 49.53,42.55
  pour Bottom (isolate 0.254, rank 2): 41.91,46.35 103.51,46.35 103.51,0.64 41.91,0.64
  pour Top (isolate 0.254, rank 2): 41.91,46.99 103.51,46.99 103.51,0.64 41.91,0.64
  pour Top (isolate 0.254): 0.64,46.35 38.1,46.35 38.1,0.64 0.64,0.64
  pour Bottom (isolate 0.254): 0.64,46.99 38.1,46.99 38.1,0.64 0.64,0.64
L-CH01
  Top 0.254: U5.37 61.47,24.89 61.47,27.37 60.44,28.4 U6.10
L-CH02
  Top 0.254: U6.9 59.79,28.47 61.05,27.21 U5.38
L-CH03
  Top 0.254: U5.43 58.55,28.07 59.14,28.66 U6.8
L-CH04
  Top 0.254: U5.44 58.05,28.21 58.49,28.65 U6.7
L-CH05
  Top 0.254: U5.45 57.55,28.34 57.84,28.63 U6.6
L-CH06
  Top 0.254: U5.46 57.05,28.48 57.19,28.62 U6.5
L-CH07
  Top 0.254: U6.4 U5.47
L-CH08
  Top 0.254: U6.3 55.99,29.41 U5.48
L-REF  (via drill 0.35 pad 0.08)
  Top 0.254: U6.24 54.61,35.24 v54.61,33.66 50.8,33.66 50.39,33.25 U7.4
  Bottom 0.254: v54.61,33.66 53.28,33.66 C17.1
LPC24  (via drill 0.35 pad 0.08)  (1 unrouted)
  Top 0.254: U5.5 v55.88,21.07 56.01,21.07 | v62.36,15.62 61.61,15.62 U5.24 | v63.5,13.21 75.06,13.21 75.56,12.7 SV4.5 | v32.38,27.3 28.57,27.3 SV10.5
  Bottom 0.254: v63.5,13.21 63.5,14.48 v62.36,15.62 61.47,16.51 60.01,16.51 58.17,18.35 58.17,18.86 57.34,19.68 R7.1 55.88,20 v55.88,21.07 | SV9.5 33.65,12.7 32.38,13.97 v32.38,27.3
LPC25  (via drill 0.35 pad 0.08)
  Top 0.254: Q2.1 72.01,19.05 v70.23,19.05 68.69,17.51 U5.25
  Bottom 0.254: C9.1 v70.23,19.05
LPC26  (via drill 0.35 pad 0.08)
  Top 0.254: Q2.2 72.01,25.4 v70.23,25.4 70.23,20.19 68.11,18.07 U5.26
  Bottom 0.254: v70.23,25.4 C2.1
LPC31  (via drill 0.35 pad 0.08)
  Top 0.254: Q3.1 67.13,24.17 v67.13,23.32 67.13,23.19 64.51,20.57 U5.31
  Bottom 0.254: v67.13,23.32 67.13,24.4 C11.1
LPC32  (via drill 0.35 pad 0.08)
  Top 0.254: Q3.4 65.2,24.17 v65.2,23.32 65.2,22.02 64.25,21.07 U5.32
  Bottom 0.254: v65.2,23.32 65.2,24.4 C12.1
LPC_DM
  Top 0.203: U5.35 61.3,22.57 54.29,15.55 U2.4
N$1
  Bottom 0.406: U1.2 90.17,18.73 R2.2
N$2
  Bottom 0.406: U3.5 100.33,26.67 99.7,27.3 | 99.7,27.3 97.47,27.3 R8.2 | C4.2 99.38,27.62 99.7,27.3
N$3
  Bottom 0.406: U3.2 100.33,23.5 99.7,24.13 96.84,24.13 R1.2
N$4
  Bottom 0.406: Q1.4 99.4,18.07 99.06,18.41 99.06,20.32 99.7,20.95 100.97,20.95 101.28,21.27 U3.1
N$5
  Bottom 0.406: U3.3 99.38,22.55 98.42,21.59 97.16,21.59 96.52,20.95 96.52,18.41 96.18,18.07 Q1.5
N$6  (via drill 0.35 pad 0.08)
  Top 0.406: v90.17,27.56 90.17,22.86 86.11,18.8 77.34,18.8 75.31,16.76 v75.31,13.97
  Bottom 0.406: v75.31,13.97 71.76,13.97 68.26,10.47 R5.1
  Bottom 0.508: U1.7 v90.17,27.56
N$7  (via drill 0.35 pad 0.08)
  Top 0.254: J4.A5 51.84,8.36 v51.05,9.14
  Bottom 0.254: v51.05,9.14 50.67,9.53 R10.2
N$8  (via drill 0.35 pad 0.08)
  Top 0.254: v62.23,1.91 TP14.TP
  Bottom 0.254: LED3.C v62.23,1.91
  Bottom 0.406: LED3.C R5.2
N$13  (via drill 0.35 pad 0.08)  (1 unrouted)
  Top 0.254: U5.28 66.06,19.07 66.67,19.68 68.58,19.68 69.56,20.66 69.56,28.6 72.71,31.75 SV5.1 | R13.2 v30.48,8.89
  Bottom 0.254: SV8.1 33.02,31.75 30.48,29.21 v30.48,8.89 31.75,8.89 31.88,8.76 R4.1
N$14
  Top 0.254: R13.1 20,3.2 S2.2
N$15  (via drill 0.35 pad 0.08)
  Top 0.254: J4.B5 54.84,8.48 v55.24,8.89
  Bottom 0.254: v55.24,8.89 | v55.24,8.89 R9.2
N$16  (via drill 0.35 pad 0.08)  (1 unrouted)
  Top 0.254: SV4.2 76.84,5.08 74.3,7.62 69.22,7.62 66.67,10.16 62.1,10.16 v60.71,11.56 | U5.21 60.05,14.58 v60.64,13.99 | SV9.2 34.92,5.08 32.38,2.54 S4.2
  Bottom 0.254: v60.64,13.99 60.71,13.93 v60.71,11.56
N$19  (via drill 0.35 pad 0.08)
  Top 0.406: v64.14,3.81 64.14,2.06 LED2.A
  Bottom 0.406: R12.1 65.09,4.76 v64.14,3.81
N$20
  Top 0.254: U6.21 56.51,35.28 56.51,36.83 55.37,37.97 55.37,40.77 55.88,41.27 J5.1
N$21
  Top 0.254: U6.20 57.15,35.3 J5.5
N$22
  Top 0.254: D2.1 8.46,10.37 9.53,11.43 R18.2
N$23
  Bottom 0.254: R15.2 65.22,32.37 D1.3
N$24
  Top 0.254: D2.2 7.11,10.92 10.16,13.97 R19.2
N$25
  Top 0.254: D2.3 5.76,11.48 10.79,16.51 R20.2
N$26
  Top 0.254: U6.19 57.84,36.89 58.42,37.47 58.42,40.01 J5.2
N$27
  pour Bottom (isolate 0.406): 103.51,46.35 103.51,30.48 81.92,30.48 81.92,46.35
N$28
  Top 0.254: U6.18 58.49,36.77 59.69,37.97 J5.6
N$29
  Top 0.254: U6.17 59.14,36.28 60.96,38.1 60.96,40.01 J5.3
N$30
  Top 0.254: U6.16 59.79,36.3 J5.7
N$31
  Top 0.254: U6.14 61.09,36.32 61.6,36.83 64.14,36.83 64.77,37.47 J5.8
N$32
  Top 0.254: U6.15 60.44,36.31 61.59,37.47 62.87,37.47 63.5,38.1 63.5,40.01 J5.4
N$33
  Top 0.203: U5.36 61.3,23.13 52.39,14.21 U2.6
N$34
  Top 0.254: U6.22 55.88,35.27 55.88,36.2 55.24,36.83 52.07,36.83 52.07,36.52 R14.1
PRG_RESET  (via drill 0.35 pad 0.08)  (1 unrouted)
  Top 0.254: U5.34 61.69,22.07 v61.57,21.94 | SV5.3 76.45,36.83 68.58,28.96 68.58,26.67 67.82,25.91 v62.23,25.91
  Bottom 0.254: S3.1_2 S3.1_1 13.34,3.79 13.34,13.34 SV10.6 33.02,33.02 33.02,35.56 34.29,36.83 SV8.3 | v61.57,21.94 60.73,21.94 R6.2 60.39,22.5 60.86,22.97 60.86,24.09 C10.1 61.27,25.71 61.47,25.91 v62.23,25.91
PRG_RXD  (via drill 0.35 pad 0.08)  (1 unrouted)
  Top 0.254: SV4.3 76.96,8.13 69.34,8.13 66.55,10.92 62.74,10.92 v62.1,11.56 | U5.22 60.55,15.01 61.09,14.48 v62.1,14.48 | R18.1 30.48,11.43 34.29,7.62 SV9.3
  Bottom 0.254: v62.1,14.48 v62.1,11.56
PRG_SWCLK  (1 unrouted)
  Top 0.254: U5.29 63.24,19.56 65.53,19.56 66.29,20.32 67.95,20.32 69.15,21.53 69.15,28.83 74.61,34.29 SV5.2 | SV10.2 SV8.2
PRG_SWDIO  (via drill 0.35 pad 0.08)  (1 unrouted)
  Top 0.254: U5.33 62.21,21.57 61.85,21.21 61.85,17.53 65.15,14.22 73.53,14.22 73.91,14.61 v73.91,15.24 | R19.1 33.02,13.97 34.29,15.24 | SV9.6 34.29,15.24 | 34.29,15.24 24.77,24.77 24.77,32.38 SV10.1
  Bottom 0.254: SV4.6 v73.91,15.24
PRG_TXD  (via drill 0.35 pad 0.08)
  Top 0.254: U5.23 61.05,18.29 60.54,18.8 v58.99,18.8 | U7.6 50.42,31.75 50.8,31.75 50.8,26.67 53.72,23.75 55.37,23.75 56.51,22.61 56.51,22.1 v57.15,21.46
  Bottom 0.254: v58.99,18.8 57.15,20.64 v57.15,21.46
RTC_BACKUP  (via drill 0.35 pad 0.08)
  Top 0.254: U5.30 65.03,20.07 v66.17,21.21 66.55,21.59 TP3.TP | TP3.TP
  Bottom 0.254: C14.1 67.12,37.27 R15.1 66.17,28.51 v66.17,21.21 67.88,21.21 C13.1
SD_CLK  (via drill 0.35 pad 0.08)  (1 unrouted)
  Top 0.254: J1.5 18.47,31.17 TP7.TP 20.96,31.75 21.59,32.38 21.59,36.2 15.88,41.91 SV7.2 | U5.1 52.56,23.13 v51.94,23.75
  Bottom 0.254: v51.94,23.75 45.59,23.75 44.45,24.89 44.45,36.83 45.85,38.23 45.85,41.4 45.34,41.91 SV3.2
SD_CS  (via drill 0.35 pad 0.08)  (1 unrouted)
  Top 0.254: J1.2 18.1,27.87 TP6.TP 19.3,26.67 20.32,26.67 22.48,28.83 v22.48,39.37 | U5.2 51.09,22.57 v50.8,22.86 | SV7.1 v16.51,39.37
  Bottom 0.254: v50.8,22.86 45.08,22.86 43.81,24.13 SV3.1 | v16.51,39.37 v22.48,39.37
SD_MISO  (via drill 0.35 pad 0.08)  (1 unrouted)
  Top 0.254: U5.15 57.05,17.05 v56.9,17.21 | TP4.TP 17.5,33.37 J1.7 13.05,33.37 11.43,31.75 11.43,18.41 4.7,11.68 4.7,6.6 3.18,5.08 SV6.1 | SV1.1 45.72,5.08 47.62,6.99 47.62,10.16 48.26,10.79 50.16,10.79 51.43,12.06 51.43,13.8 52.2,14.56 52.2,15.75 v53.09,16.64
  Bottom 0.254: 55.24,15.23 R11.1 54.61,16.64 | v56.9,17.21 55.18,17.21 54.61,16.64 | 54.61,16.64 v53.09,16.64
SD_MOSI  (via drill 0.35 pad 0.08)  (1 unrouted)
  Top 0.254: TP9.TP 18.65,28.97 J1.3 15,28.97 13.97,27.94 v13.97,19.05 | SV1.2 46.35,7.62 46.99,8.26 46.99,10.16 48.26,11.43 50.16,11.43 50.8,12.06 50.8,13.97 51.69,14.86 51.69,16.76 52.43,17.51 U5.12 | SV6.2 2.54,11.43 v10.16,19.05
  Bottom 0.254: v10.16,19.05 v13.97,19.05
STATUS  (via drill 0.35 pad 0.08)
  Top 0.254: v81.03,22.43 80.83,22.23 TP1.TP
  Bottom 0.254: IC1.8 81.03,22.33 v81.03,22.43
USB_DN
  Top 0.254: 52.34,7.94 52.34,8.26 52.34,9.49 U2.1 | J4.A7 53.34,7.62 53.02,7.94 52.34,7.94 | J4.B7 52.34,7.94
USB_DP
  Top 0.254: U2.3 54.29,8.57 53.84,8.12 J4.B6 53.84,5.96 53.59,5.71 52.96,5.71 52.84,5.84 J4.A6
VCC  (via drill 0.35 pad 0.08)
  Top 0.254: TP13.TP v81.92,21.59
  Bottom 0.254: C6.1 84.14,20.32 83.82,20.32
  Bottom 0.305: IC1.7 79.62,21.59 | IC1.2 79.62,21.59 | 79.62,21.59 80.65,21.59
  Bottom 0.61: 80.65,21.59 v81.92,21.59 82.55,21.59 83.82,20.32 85.09,19.05 U4.8

### Text on the board
Dimension: 47mm | 39mm | 63mm